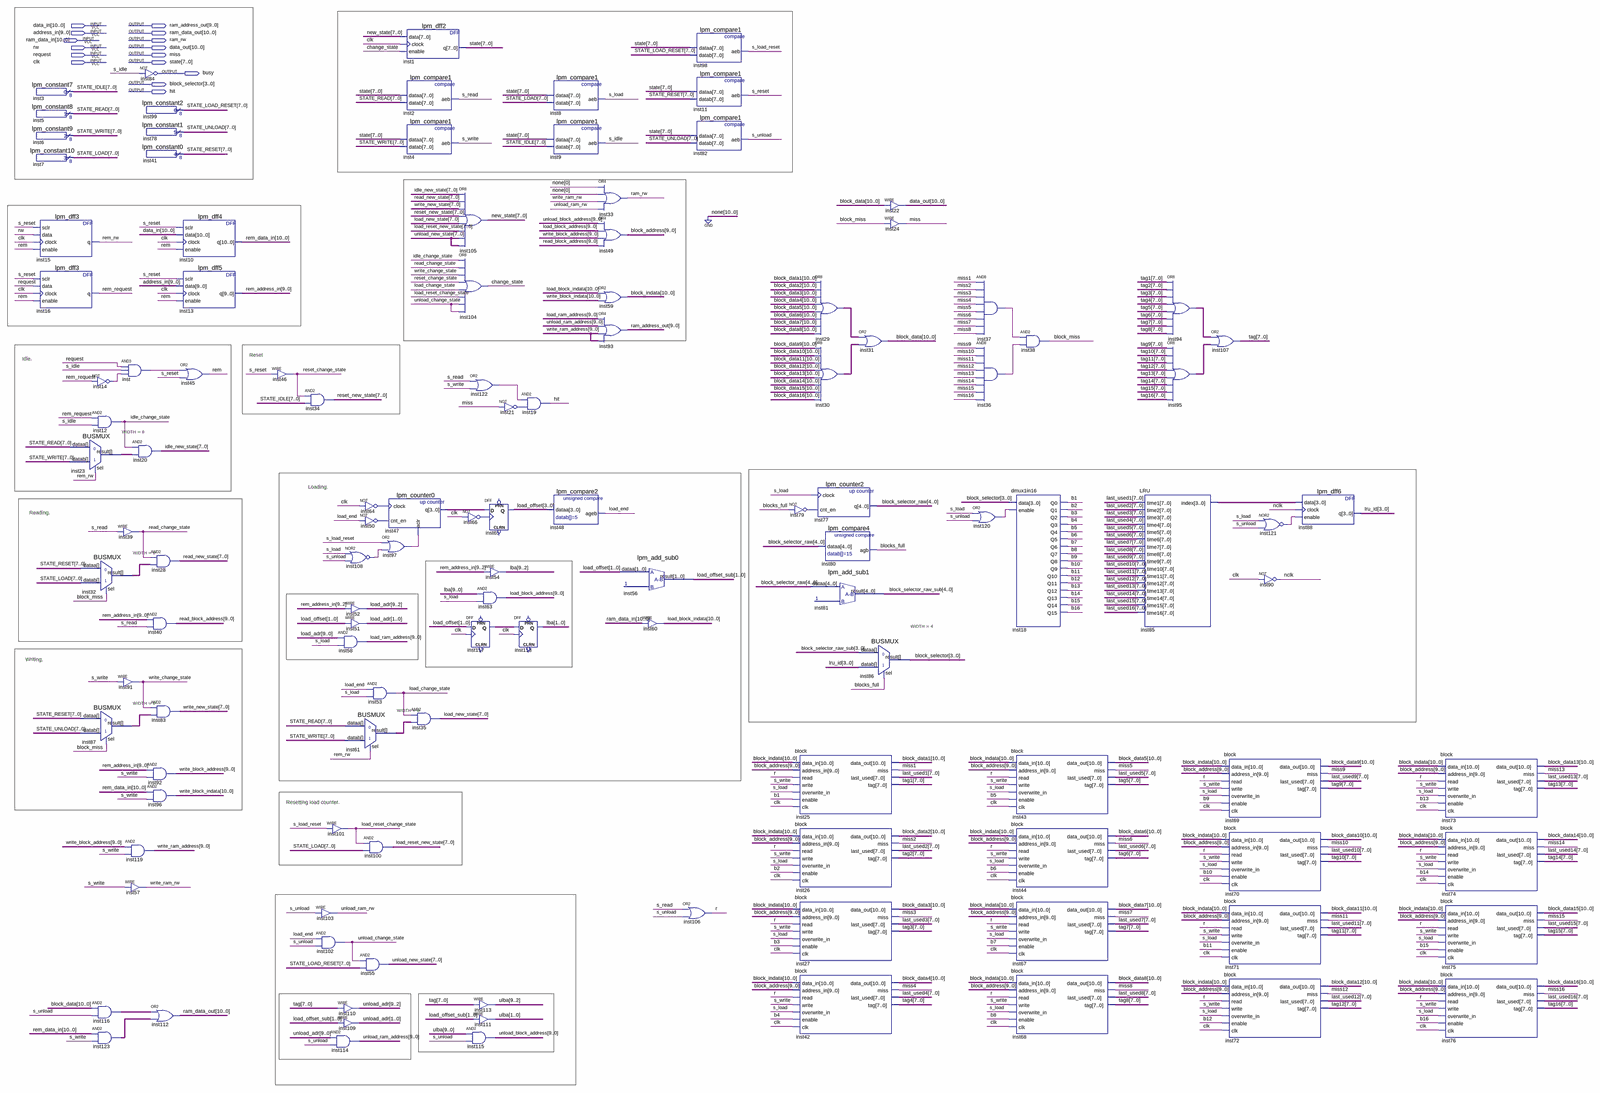
[diagram p0: schematic sheet, whole]
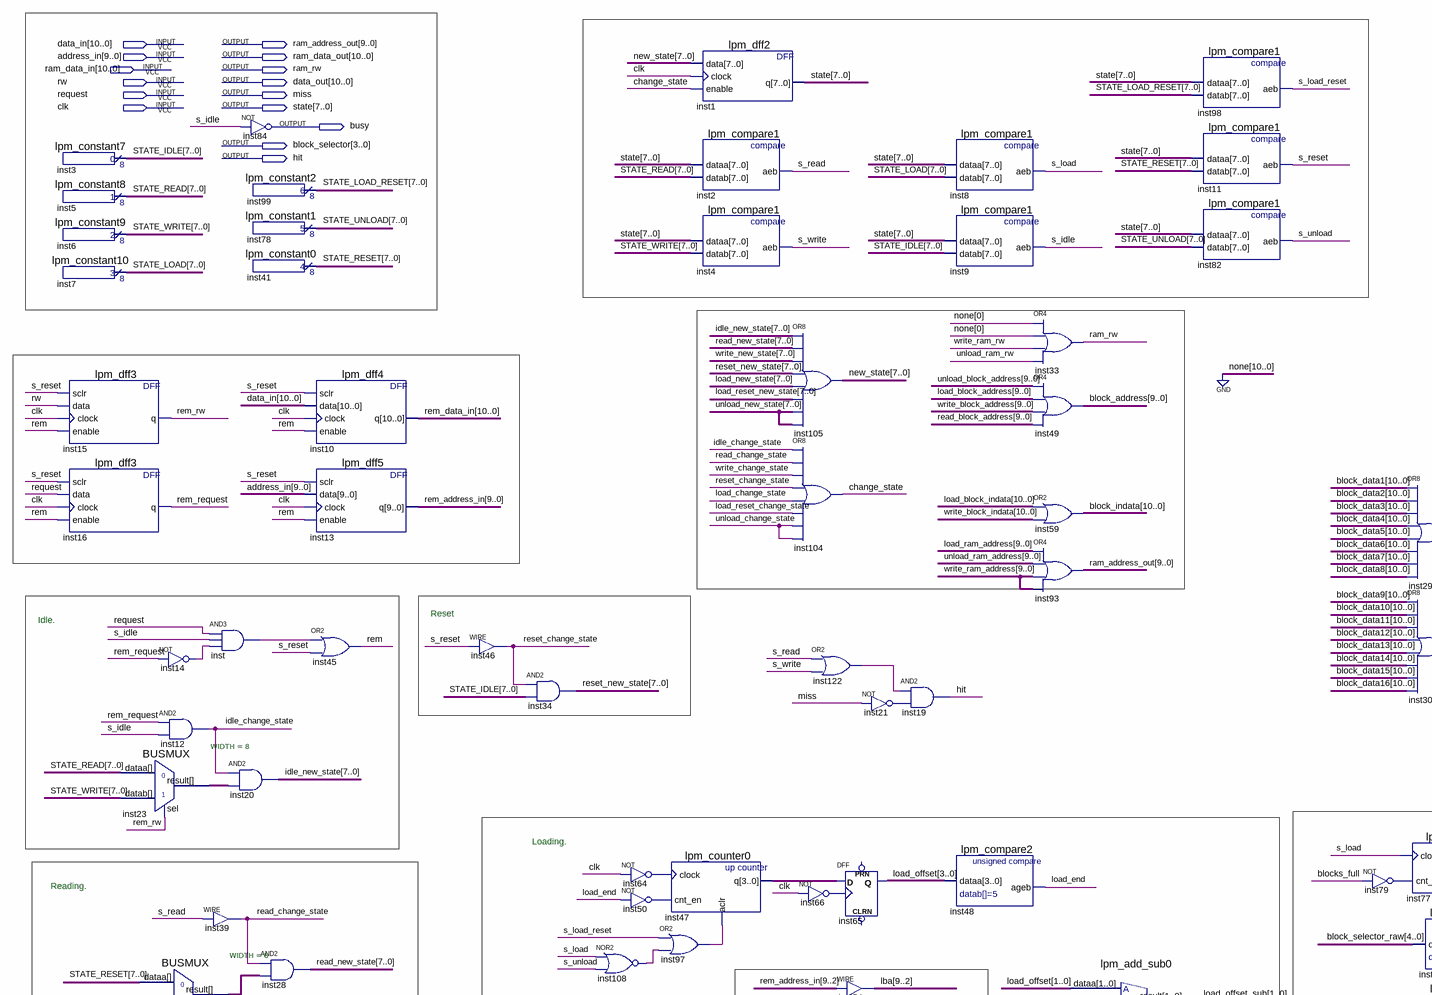
[diagram p1: schematic sheet, upper left part]
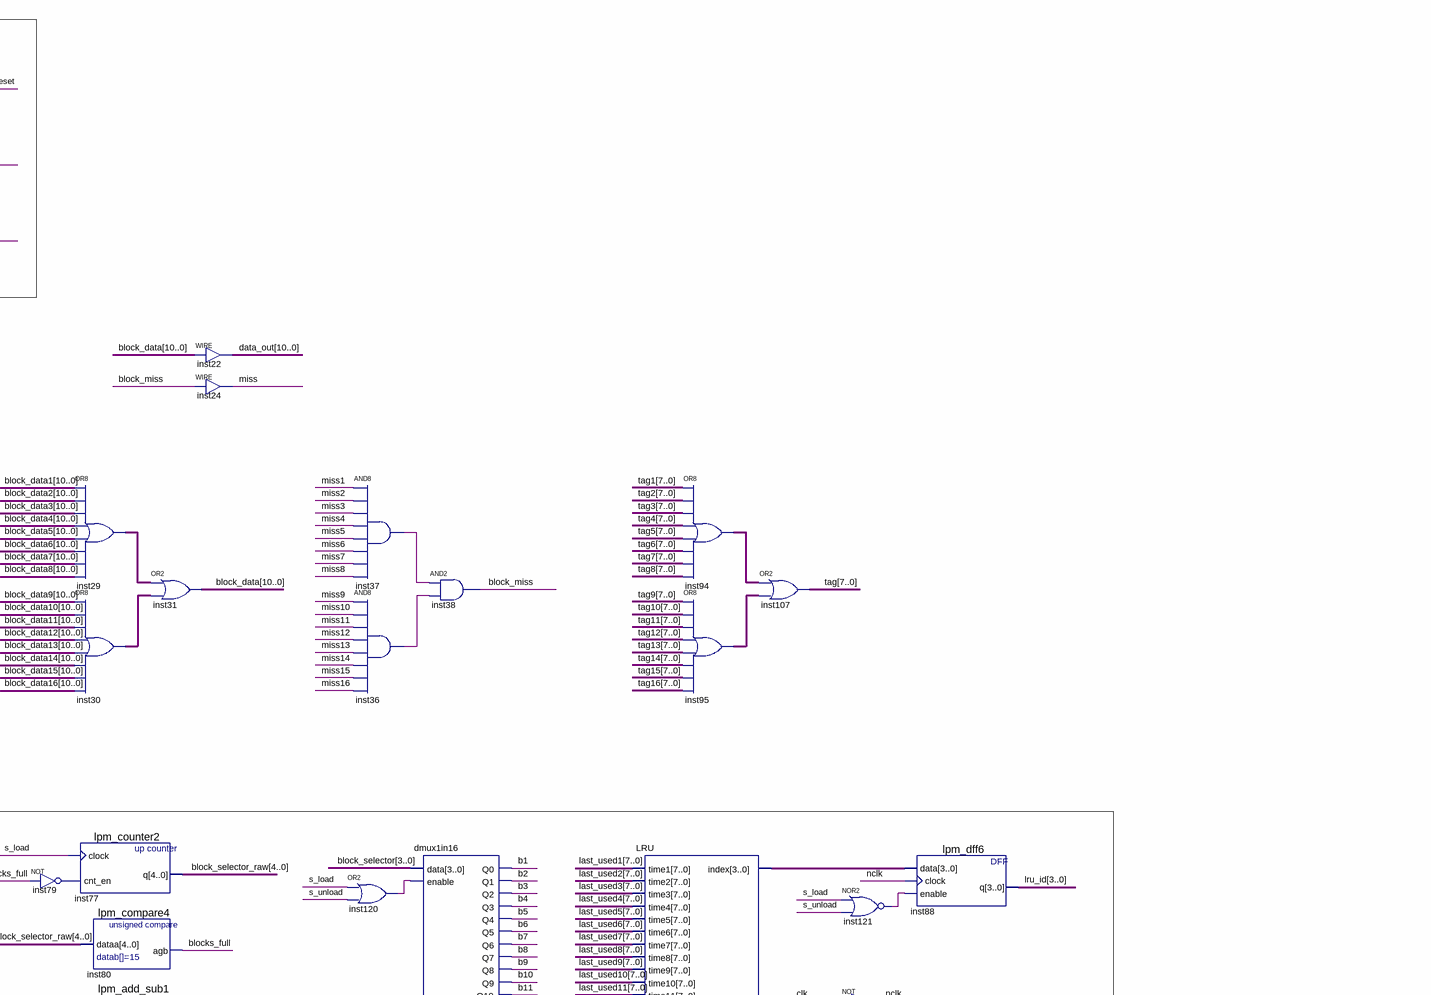
[diagram p2: schematic sheet, upper right part]
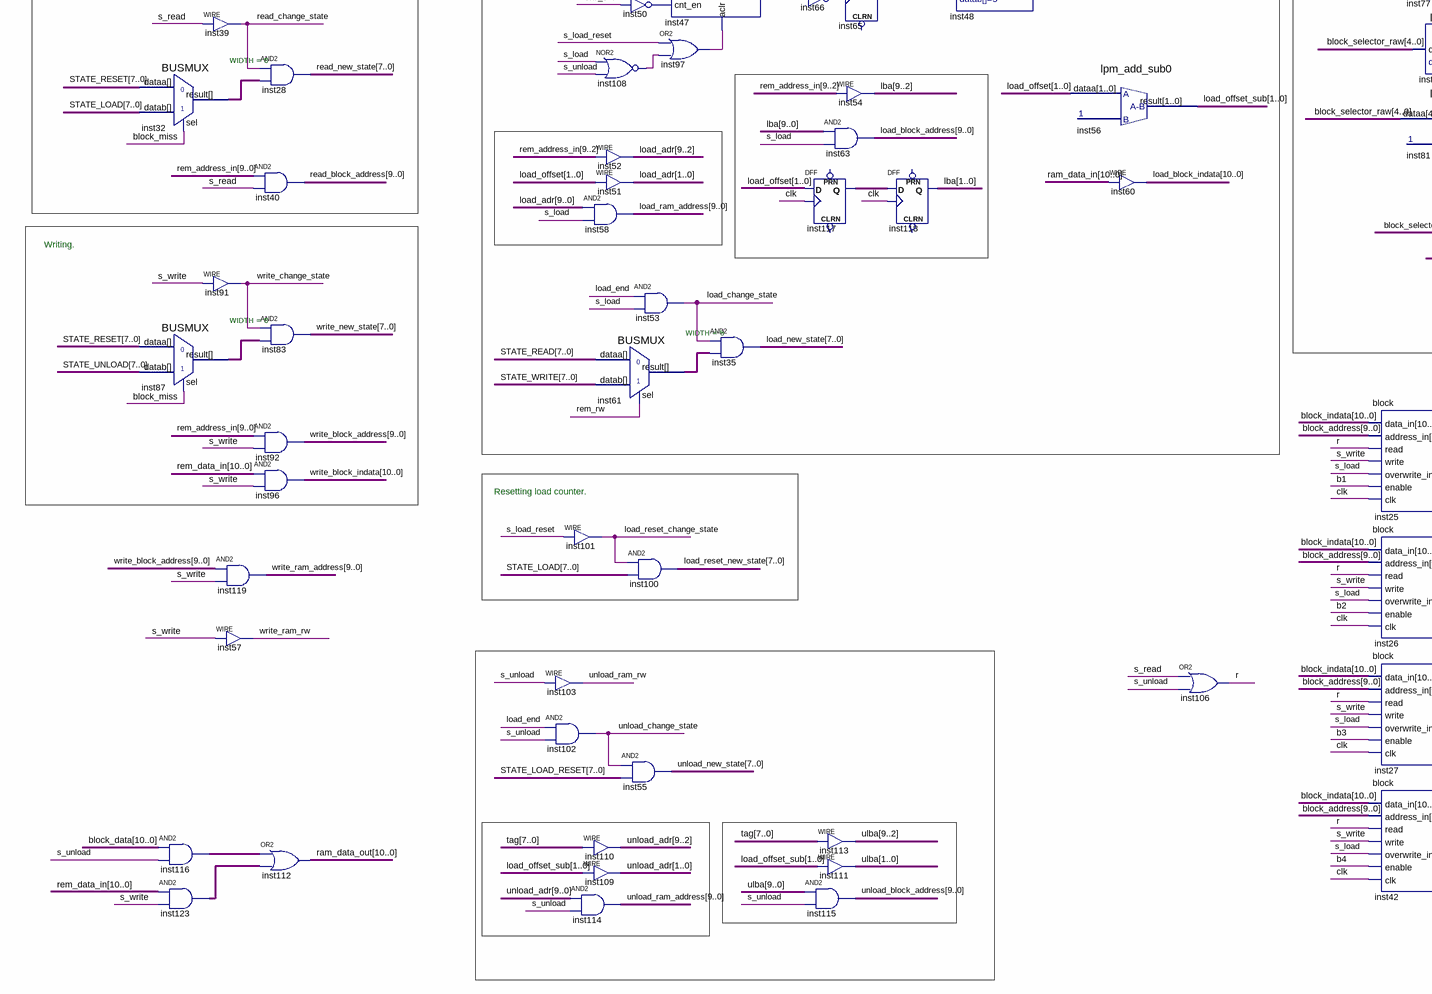
[diagram p3: schematic sheet, lower left part]
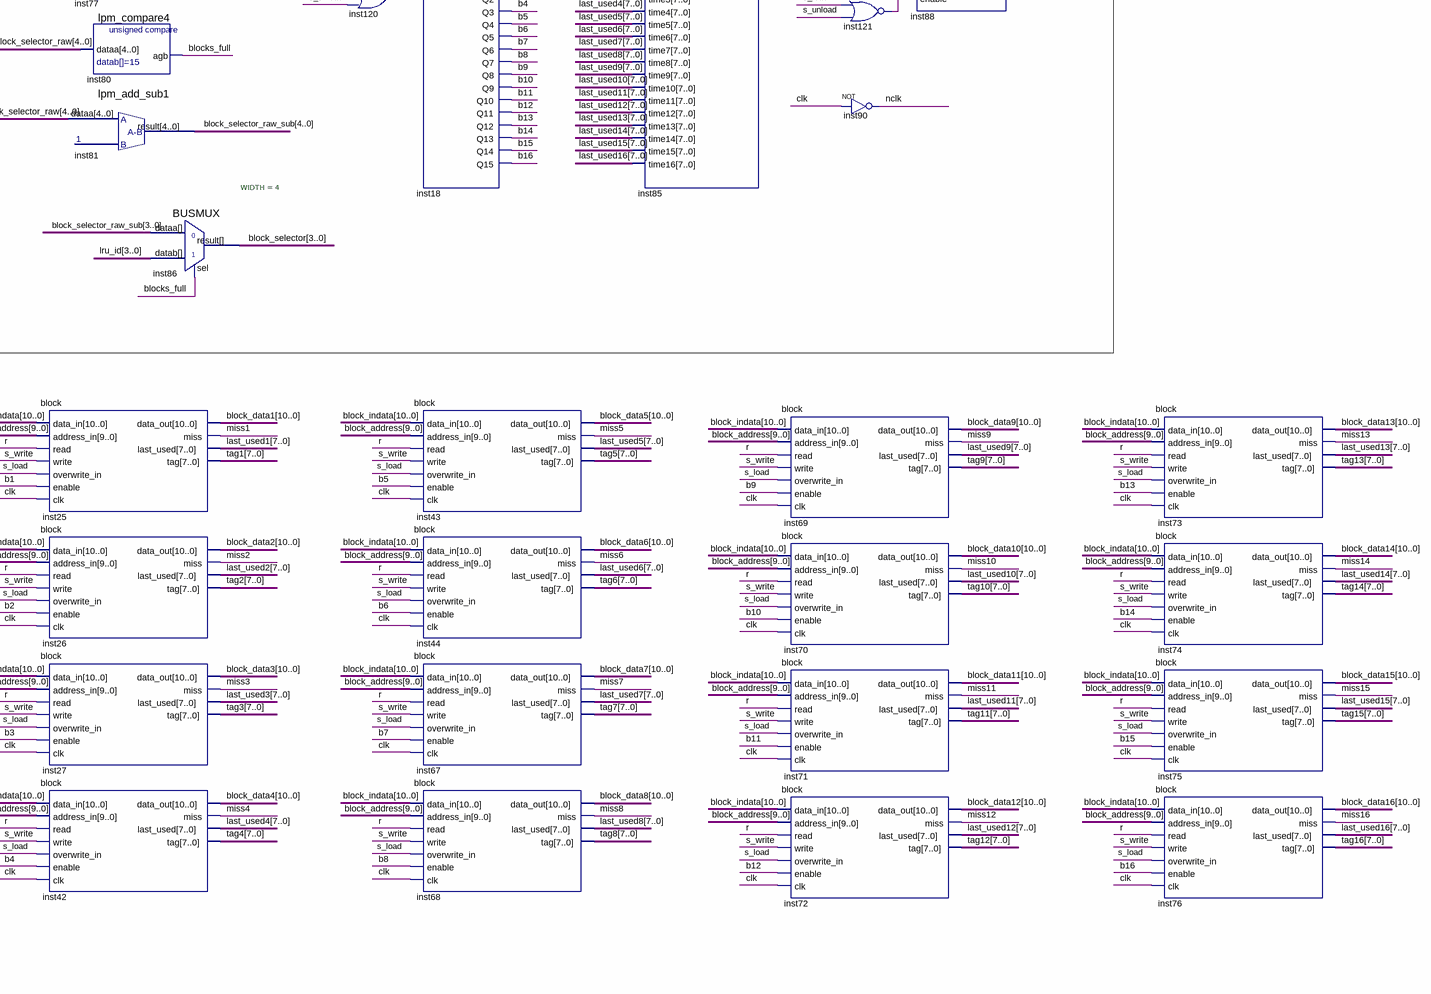
[diagram p4: schematic sheet, lower right part]
// Quartus schematic cache.bdf as structural Verilog: 121 symbols, 15 pins
module cache (
  input  [10:0] data_in,
  input  [9:0] address_in,
  input  [10:0] ram_data_in,
  input  rw,
  input  request,
  input  clk,
  output [9:0] ram_address_out,
  output [10:0] ram_data_out,
  output ram_rw,
  output [10:0] data_out,
  output miss,
  output [7:0] state,
  output busy,
  output [3:0] block_selector,
  output hit
);

  wire b1, b2, b3, b4, b5, b6, b7, b8, b9, b10, b11, b12, b13, b14, b15, b16, block_miss, blocks_full,
       change_state, idle_change_state, inst14_out, inst21_out, inst36_out, inst37_out, inst50_out,
       inst64_out, inst66_out, inst79_out, inst97_out, inst108_out, inst120_out, inst121_out, inst122_out,
       inst_out, load_change_state, load_end, load_reset_change_state, miss1, miss2, miss3, miss4, miss5,
       miss6, miss7, miss8, miss9, miss10, miss11, miss12, miss13, miss14, miss15, miss16, nclk, r,
       read_change_state, rem, rem_request, rem_rw, reset_change_state, s_idle, s_load, s_load_reset, s_read,
       s_reset, s_unload, s_write, unload_change_state, unload_ram_rw, write_change_state, write_ram_rw;
  wire [1:0] inst117_q, load_offset_sub;
  wire [3:0] inst47_q, inst85_index, load_offset, lru_id;
  wire [4:0] block_selector_raw, block_selector_raw_sub;
  wire [7:0] idle_new_state, inst23_result, inst32_result, inst61_result, inst87_result, inst94_out,
       inst95_out, last_used1, last_used2, last_used3, last_used4, last_used5, last_used6, last_used7,
       last_used8, last_used9, last_used10, last_used11, last_used12, last_used13, last_used14, last_used15,
       last_used16, load_new_state, load_reset_new_state, new_state, read_new_state, reset_new_state,
       STATE_IDLE, STATE_LOAD, STATE_LOAD_RESET, STATE_READ, STATE_RESET, STATE_UNLOAD, STATE_WRITE, tag,
       tag1, tag2, tag3, tag4, tag5, tag6, tag7, tag8, tag9, tag10, tag11, tag12, tag13, tag14, tag15, tag16,
       unload_new_state, write_new_state;
  wire [9:0] block_address, lba, load_adr, load_block_address, load_ram_address, read_block_address,
       rem_address_in, ulba, unload_adr, unload_block_address, unload_ram_address, write_block_address,
       write_ram_address;
  wire [10:0] block_data, block_data1, block_data2, block_data3, block_data4, block_data5, block_data6,
       block_data7, block_data8, block_data9, block_data10, block_data11, block_data12, block_data13,
       block_data14, block_data15, block_data16, block_indata, inst29_out, inst30_out, inst116_out,
       inst123_out, load_block_indata, rem_data_in, write_block_indata;

  lpm_constant7 inst3 (.result(STATE_IDLE));
  lpm_constant8 inst5 (.result(STATE_READ));
  lpm_constant9 inst6 (.result(STATE_WRITE));
  lpm_constant10 inst7 (.result(STATE_LOAD));
  lpm_dff3 inst15 (.sclr(s_reset), .data(rw), .clock(clk), .enable(rem), .q(rem_rw));
  lpm_dff3 inst16 (.sclr(s_reset), .data(request), .clock(clk), .enable(rem), .q(rem_request));
  BUSMUX #(.WIDTH(8)) inst23 (.datab(STATE_WRITE), .sel(rem_rw), .dataa(STATE_READ), .result(inst23_result));
  BUSMUX #(.WIDTH(8)) inst32 (.datab(STATE_LOAD), .sel(block_miss), .dataa(STATE_RESET), .result(inst32_result));
  BUSMUX #(.WIDTH(8)) inst87 (.datab(STATE_UNLOAD), .sel(block_miss), .dataa(STATE_RESET), .result(inst87_result));
  not inst14 (inst14_out, rem_request);
  and inst12 (idle_change_state, rem_request, s_idle);
  assign read_change_state = s_read;  // WIRE inst39
  assign write_change_state = s_write;  // WIRE inst91
  assign inst116_out = block_data & {11{s_unload}};  // AND2 inst116, 11 bits wide
  assign inst123_out = rem_data_in & {11{s_write}};  // AND2 inst123, 11 bits wide
  not inst84 (busy, s_idle);
  lpm_constant2 inst99 (.result(STATE_LOAD_RESET));
  lpm_constant1 inst78 (.result(STATE_UNLOAD));
  lpm_constant0 inst41 (.result(STATE_RESET));
  and inst (inst_out, request, s_idle, inst14_out);
  assign idle_new_state = {8{idle_change_state}} & inst23_result;  // AND2 inst20, 8 bits wide
  assign read_block_address = rem_address_in & {10{s_read}};  // AND2 inst40, 10 bits wide
  assign write_block_address = rem_address_in & {10{s_write}};  // AND2 inst92, 10 bits wide
  assign write_block_indata = rem_data_in & {11{s_write}};  // AND2 inst96, 11 bits wide
  assign write_ram_address = write_block_address & {10{s_write}};  // AND2 inst119, 10 bits wide
  assign write_ram_rw = s_write;  // WIRE inst57
  lpm_dff4 inst10 (.sclr(s_reset), .data(data_in), .clock(clk), .enable(rem), .q(rem_data_in));
  lpm_dff5 inst13 (.sclr(s_reset), .data(address_in), .clock(clk), .enable(rem), .q(rem_address_in));
  assign read_new_state = {8{read_change_state}} & inst32_result;  // AND2 inst28, 8 bits wide
  assign write_new_state = {8{write_change_state}} & inst87_result;  // AND2 inst83, 8 bits wide
  assign ram_data_out = inst116_out | inst123_out;  // OR2 inst112, 11 bits wide
  or inst45 (rem, inst_out, s_reset);
  assign reset_change_state = s_reset;  // WIRE inst46
  assign reset_new_state = {8{reset_change_state}} & STATE_IDLE;  // AND2 inst34, 8 bits wide
  assign unload_ram_rw = s_unload;  // WIRE inst103
  and inst102 (unload_change_state, load_end, s_unload);
  nor inst108 (inst108_out, s_load, s_unload);
  assign load_adr[9:2] = rem_address_in[9:2];  // WIRE inst52
  assign load_adr[1:0] = load_offset[1:0];  // WIRE inst51
  assign load_ram_address = load_adr & {10{s_load}};  // AND2 inst58, 10 bits wide
  BUSMUX #(.WIDTH(8)) inst61 (.datab(STATE_WRITE), .sel(rem_rw), .dataa(STATE_READ), .result(inst61_result));
  assign load_reset_change_state = s_load_reset;  // WIRE inst101
  assign unload_adr[9:2] = tag;  // WIRE inst110
  assign unload_adr[1:0] = load_offset_sub;  // WIRE inst109
  assign unload_ram_address = unload_adr & {10{s_unload}};  // AND2 inst114, 10 bits wide
  lpm_counter0 inst47 (.clock(inst64_out), .cnt_en(inst50_out), .aclr(inst97_out), .q(inst47_q));
  not inst64 (inst64_out, clk);
  not inst50 (inst50_out, load_end);
  or inst97 (inst97_out, s_load_reset, inst108_out);
  and inst53 (load_change_state, load_end, s_load);
  assign load_reset_new_state = {8{load_reset_change_state}} & STATE_LOAD;  // AND2 inst100, 8 bits wide
  assign unload_new_state = {8{unload_change_state}} & STATE_LOAD_RESET;  // AND2 inst55, 8 bits wide
  lpm_dff2 inst1 (.data(new_state), .clock(clk), .enable(change_state), .q(state));
  lpm_compare1 inst2 (.dataa(state), .datab(STATE_READ), .aeb(s_read));
  lpm_compare1 inst4 (.dataa(state), .datab(STATE_WRITE), .aeb(s_write));
  assign load_new_state = {8{load_change_state}} & inst61_result;  // AND2 inst35, 8 bits wide
  assign new_state = idle_new_state | read_new_state | write_new_state | reset_new_state | load_new_state | load_reset_new_state | unload_new_state | unload_new_state;  // OR8 inst105, 8 bits wide
  or inst104 (change_state, idle_change_state, read_change_state, write_change_state, reset_change_state, load_change_state, load_reset_change_state, unload_change_state, unload_change_state);
  or inst122 (inst122_out, s_read, s_write);
  not inst66 (inst66_out, clk);
  DFF inst117[1:0] (.CLK(clk), .D(load_offset[1:0]), .Q(inst117_q));  // open: CLRN, PRN
  assign unload_block_address = ulba & {10{s_unload}};  // AND2 inst115, 10 bits wide
  not inst21 (inst21_out, miss);
  DFF inst65[3:0] (.CLK(inst66_out), .D(inst47_q), .Q(load_offset));  // open: CLRN, PRN
  assign lba[9:2] = rem_address_in[9:2];  // WIRE inst54
  assign load_block_address = lba & {10{s_load}};  // AND2 inst63, 10 bits wide
  assign ulba[9:2] = tag;  // WIRE inst113
  assign ulba[1:0] = load_offset_sub;  // WIRE inst111
  and inst19 (hit, inst122_out, inst21_out);
  DFF inst118[1:0] (.CLK(clk), .D(inst117_q), .Q(lba[1:0]));  // open: CLRN, PRN
  lpm_compare1 inst8 (.dataa(state), .datab(STATE_LOAD), .aeb(s_load));
  lpm_compare1 inst9 (.dataa(state), .datab(STATE_IDLE), .aeb(s_idle));
  lpm_compare2 inst48 (.dataa(load_offset), .ageb(load_end));
  or inst33 (ram_rw, 1'b0, 1'b0, write_ram_rw, unload_ram_rw);
  assign block_address = unload_block_address | load_block_address | write_block_address | read_block_address;  // OR4 inst49, 10 bits wide
  assign block_indata = load_block_indata | write_block_indata;  // OR2 inst59, 11 bits wide
  assign ram_address_out = load_ram_address | unload_ram_address | write_ram_address | write_ram_address;  // OR4 inst93, 10 bits wide
  lpm_add_sub0 inst56 (.dataa(load_offset[1:0]), .result(load_offset_sub));
  assign load_block_indata = ram_data_in;  // WIRE inst60
  lpm_compare1 inst98 (.dataa(state), .datab(STATE_LOAD_RESET), .aeb(s_load_reset));
  lpm_compare1 inst11 (.dataa(state), .datab(STATE_RESET), .aeb(s_reset));
  lpm_compare1 inst82 (.dataa(state), .datab(STATE_UNLOAD), .aeb(s_unload));
  or inst106 (r, s_read, s_unload);
  not inst79 (inst79_out, blocks_full);
  block inst25 (
    .data_in(block_indata), .address_in(block_address), .read(r), .write(s_write), .overwrite_in(s_load),
    .enable(b1), .clk(clk), .data_out(block_data1), .miss(miss1), .last_used(last_used1), .tag(tag1));
  block inst26 (
    .data_in(block_indata), .address_in(block_address), .read(r), .write(s_write), .overwrite_in(s_load),
    .enable(b2), .clk(clk), .data_out(block_data2), .miss(miss2), .last_used(last_used2), .tag(tag2));
  block inst27 (
    .data_in(block_indata), .address_in(block_address), .read(r), .write(s_write), .overwrite_in(s_load),
    .enable(b3), .clk(clk), .data_out(block_data3), .miss(miss3), .last_used(last_used3), .tag(tag3));
  block inst42 (
    .data_in(block_indata), .address_in(block_address), .read(r), .write(s_write), .overwrite_in(s_load),
    .enable(b4), .clk(clk), .data_out(block_data4), .miss(miss4), .last_used(last_used4), .tag(tag4));
  assign inst29_out = block_data1 | block_data2 | block_data3 | block_data4 | block_data5 | block_data6 | block_data7 | block_data8;  // OR8 inst29, 11 bits wide
  assign inst30_out = block_data9 | block_data10 | block_data11 | block_data12 | block_data13 | block_data14 | block_data15 | block_data16;  // OR8 inst30, 11 bits wide
  lpm_counter2 inst77 (.clock(s_load), .cnt_en(inst79_out), .q(block_selector_raw));
  lpm_compare4 inst80 (.dataa(block_selector_raw), .agb(blocks_full));
  lpm_add_sub1 inst81 (.dataa(block_selector_raw), .result(block_selector_raw_sub));
  assign block_data = inst29_out | inst30_out;  // OR2 inst31, 11 bits wide
  BUSMUX #(.WIDTH(4)) inst86 (
    .datab(lru_id), .sel(blocks_full), .dataa(block_selector_raw_sub[3:0]), .result(block_selector));
  assign data_out = block_data;  // WIRE inst22
  assign miss = block_miss;  // WIRE inst24
  and inst37 (inst37_out, miss1, miss2, miss3, miss4, miss5, miss6, miss7, miss8);
  and inst36 (inst36_out, miss9, miss10, miss11, miss12, miss13, miss14, miss15, miss16);
  or inst120 (inst120_out, s_load, s_unload);
  and inst38 (block_miss, inst37_out, inst36_out);
  dmux1in16 inst18 (
    .data(block_selector), .enable(inst120_out), .Q0(b1), .Q1(b2), .Q2(b3), .Q3(b4), .Q4(b5), .Q5(b6),
    .Q6(b7), .Q7(b8), .Q8(b9), .Q9(b10), .Q10(b11), .Q11(b12), .Q12(b13), .Q13(b14), .Q14(b15), .Q15(b16));
  block inst43 (
    .data_in(block_indata), .address_in(block_address), .read(r), .write(s_write), .overwrite_in(s_load),
    .enable(b5), .clk(clk), .data_out(block_data5), .miss(miss5), .last_used(last_used5), .tag(tag5));
  block inst44 (
    .data_in(block_indata), .address_in(block_address), .read(r), .write(s_write), .overwrite_in(s_load),
    .enable(b6), .clk(clk), .data_out(block_data6), .miss(miss6), .last_used(last_used6), .tag(tag6));
  block inst67 (
    .data_in(block_indata), .address_in(block_address), .read(r), .write(s_write), .overwrite_in(s_load),
    .enable(b7), .clk(clk), .data_out(block_data7), .miss(miss7), .last_used(last_used7), .tag(tag7));
  block inst68 (
    .data_in(block_indata), .address_in(block_address), .read(r), .write(s_write), .overwrite_in(s_load),
    .enable(b8), .clk(clk), .data_out(block_data8), .miss(miss8), .last_used(last_used8), .tag(tag8));
  LRU inst85 (
    .time1(last_used1), .time2(last_used2), .time3(last_used3), .time4(last_used4), .time5(last_used5),
    .time6(last_used6), .time7(last_used7), .time8(last_used8), .time9(last_used9), .time10(last_used10),
    .time11(last_used11), .time12(last_used12), .time13(last_used13), .time14(last_used14),
    .time15(last_used15), .time16(last_used16), .index(inst85_index));
  assign inst94_out = tag1 | tag2 | tag3 | tag4 | tag5 | tag6 | tag7 | tag8;  // OR8 inst94, 8 bits wide
  assign inst95_out = tag9 | tag10 | tag11 | tag12 | tag13 | tag14 | tag15 | tag16;  // OR8 inst95, 8 bits wide
  assign tag = inst94_out | inst95_out;  // OR2 inst107, 8 bits wide
  block inst69 (
    .data_in(block_indata), .address_in(block_address), .read(r), .write(s_write), .overwrite_in(s_load),
    .enable(b9), .clk(clk), .data_out(block_data9), .miss(miss9), .last_used(last_used9), .tag(tag9));
  block inst70 (
    .data_in(block_indata), .address_in(block_address), .read(r), .write(s_write), .overwrite_in(s_load),
    .enable(b10), .clk(clk), .data_out(block_data10), .miss(miss10), .last_used(last_used10), .tag(tag10));
  block inst71 (
    .data_in(block_indata), .address_in(block_address), .read(r), .write(s_write), .overwrite_in(s_load),
    .enable(b11), .clk(clk), .data_out(block_data11), .miss(miss11), .last_used(last_used11), .tag(tag11));
  block inst72 (
    .data_in(block_indata), .address_in(block_address), .read(r), .write(s_write), .overwrite_in(s_load),
    .enable(b12), .clk(clk), .data_out(block_data12), .miss(miss12), .last_used(last_used12), .tag(tag12));
  nor inst121 (inst121_out, s_load, s_unload);
  not inst90 (nclk, clk);
  lpm_dff6 inst88 (.data(inst85_index), .clock(nclk), .enable(inst121_out), .q(lru_id));
  block inst73 (
    .data_in(block_indata), .address_in(block_address), .read(r), .write(s_write), .overwrite_in(s_load),
    .enable(b13), .clk(clk), .data_out(block_data13), .miss(miss13), .last_used(last_used13), .tag(tag13));
  block inst74 (
    .data_in(block_indata), .address_in(block_address), .read(r), .write(s_write), .overwrite_in(s_load),
    .enable(b14), .clk(clk), .data_out(block_data14), .miss(miss14), .last_used(last_used14), .tag(tag14));
  block inst75 (
    .data_in(block_indata), .address_in(block_address), .read(r), .write(s_write), .overwrite_in(s_load),
    .enable(b15), .clk(clk), .data_out(block_data15), .miss(miss15), .last_used(last_used15), .tag(tag15));
  block inst76 (
    .data_in(block_indata), .address_in(block_address), .read(r), .write(s_write), .overwrite_in(s_load),
    .enable(b16), .clk(clk), .data_out(block_data16), .miss(miss16), .last_used(last_used16), .tag(tag16));

  // Notes on the sheet:
  //   Reset
  //   Idle.
  //   Loading.
  //   Reading.
  //   Writing.
  //   Resetting load counter.
endmodule
